# Altium schematic sheet main_scheme.SchDoc
size A1; DocumentNumber: 1; SheetNumber: 1; SheetTotal: 8
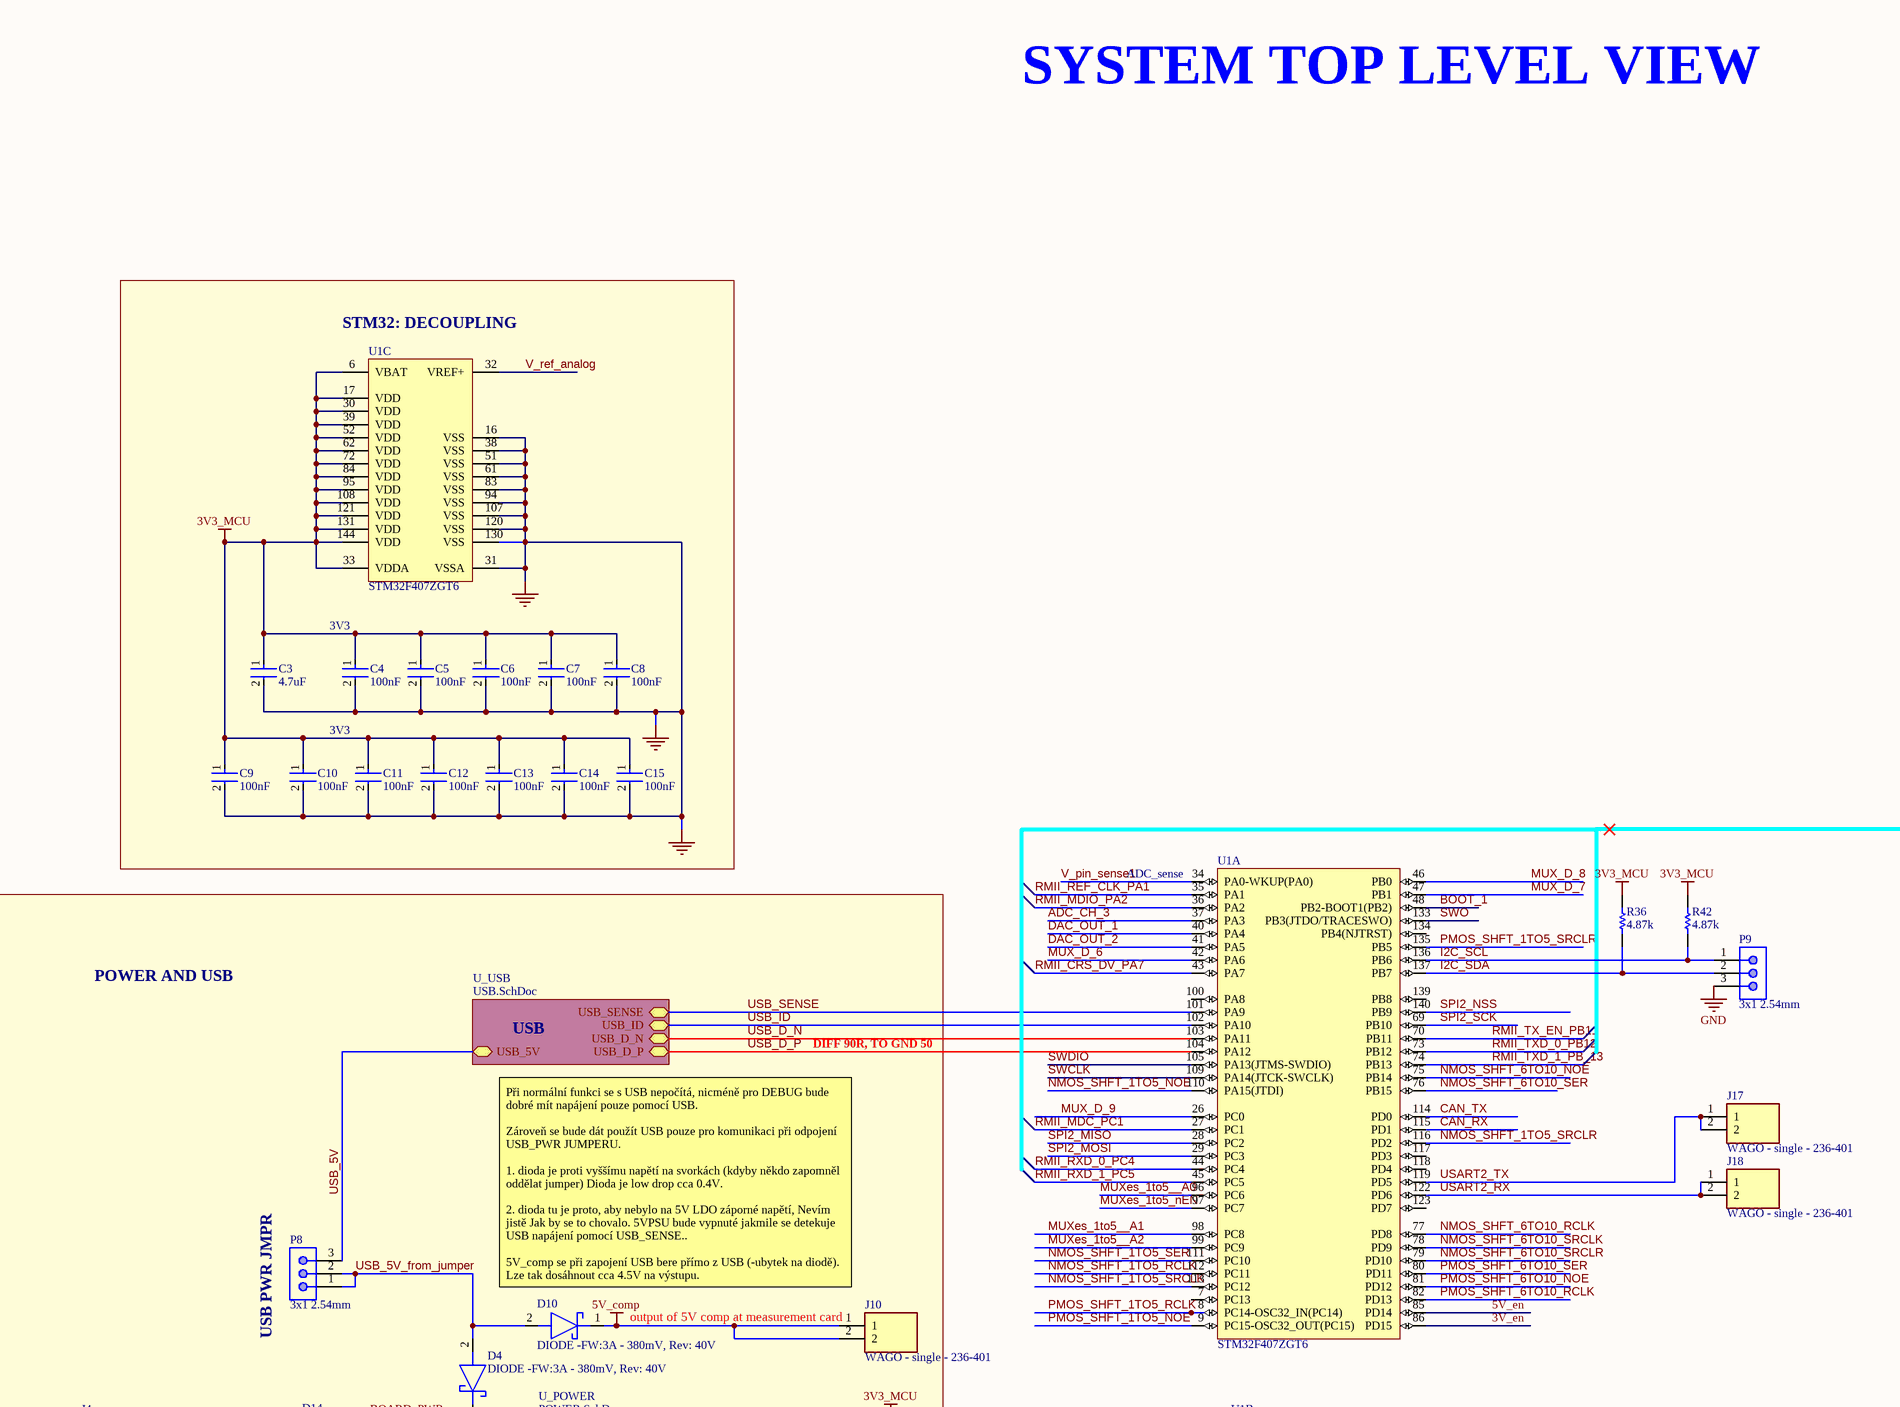
[diagram p0: main_scheme.SchDoc, top left]
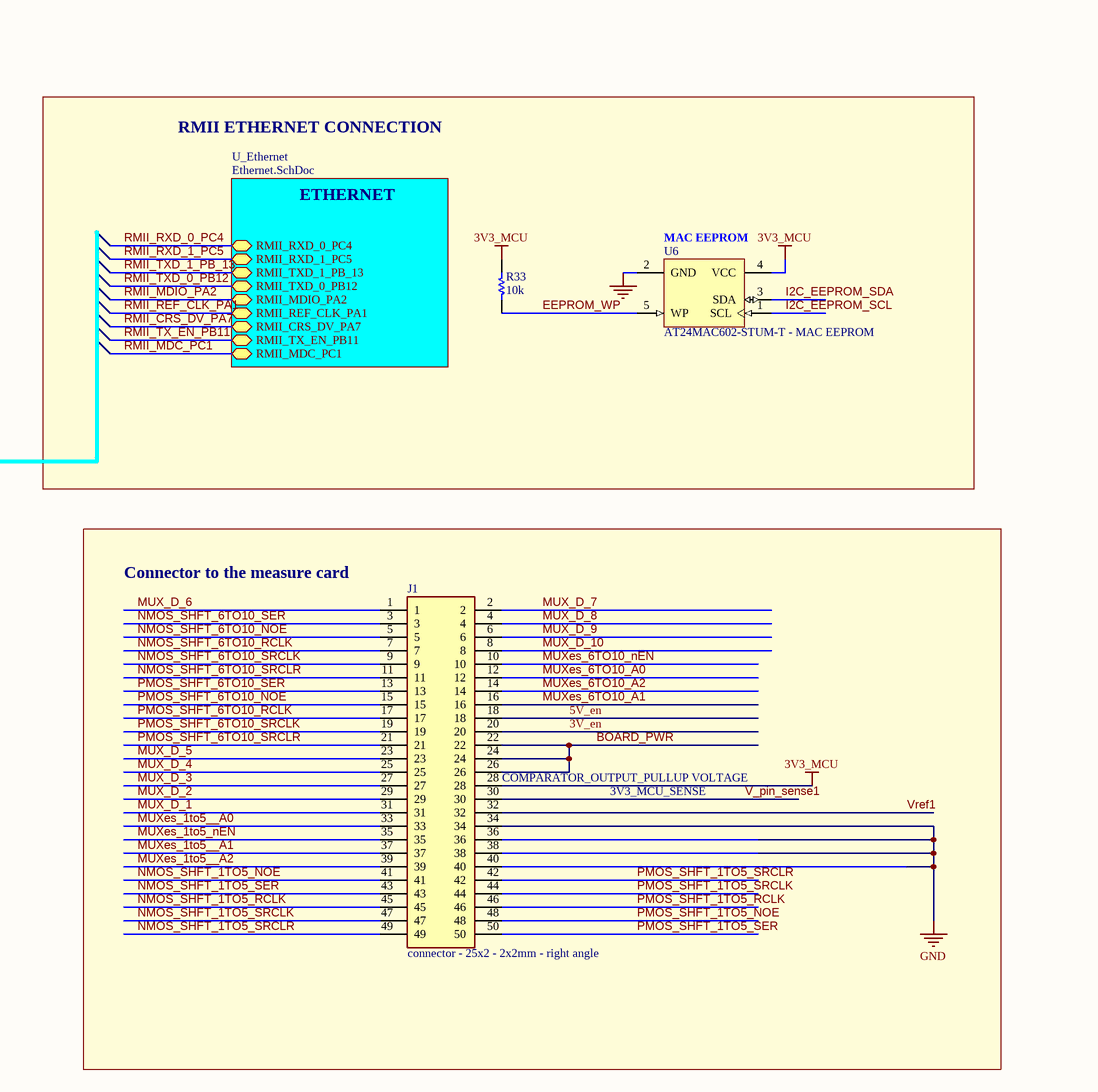
[diagram p1: main_scheme.SchDoc, top right]
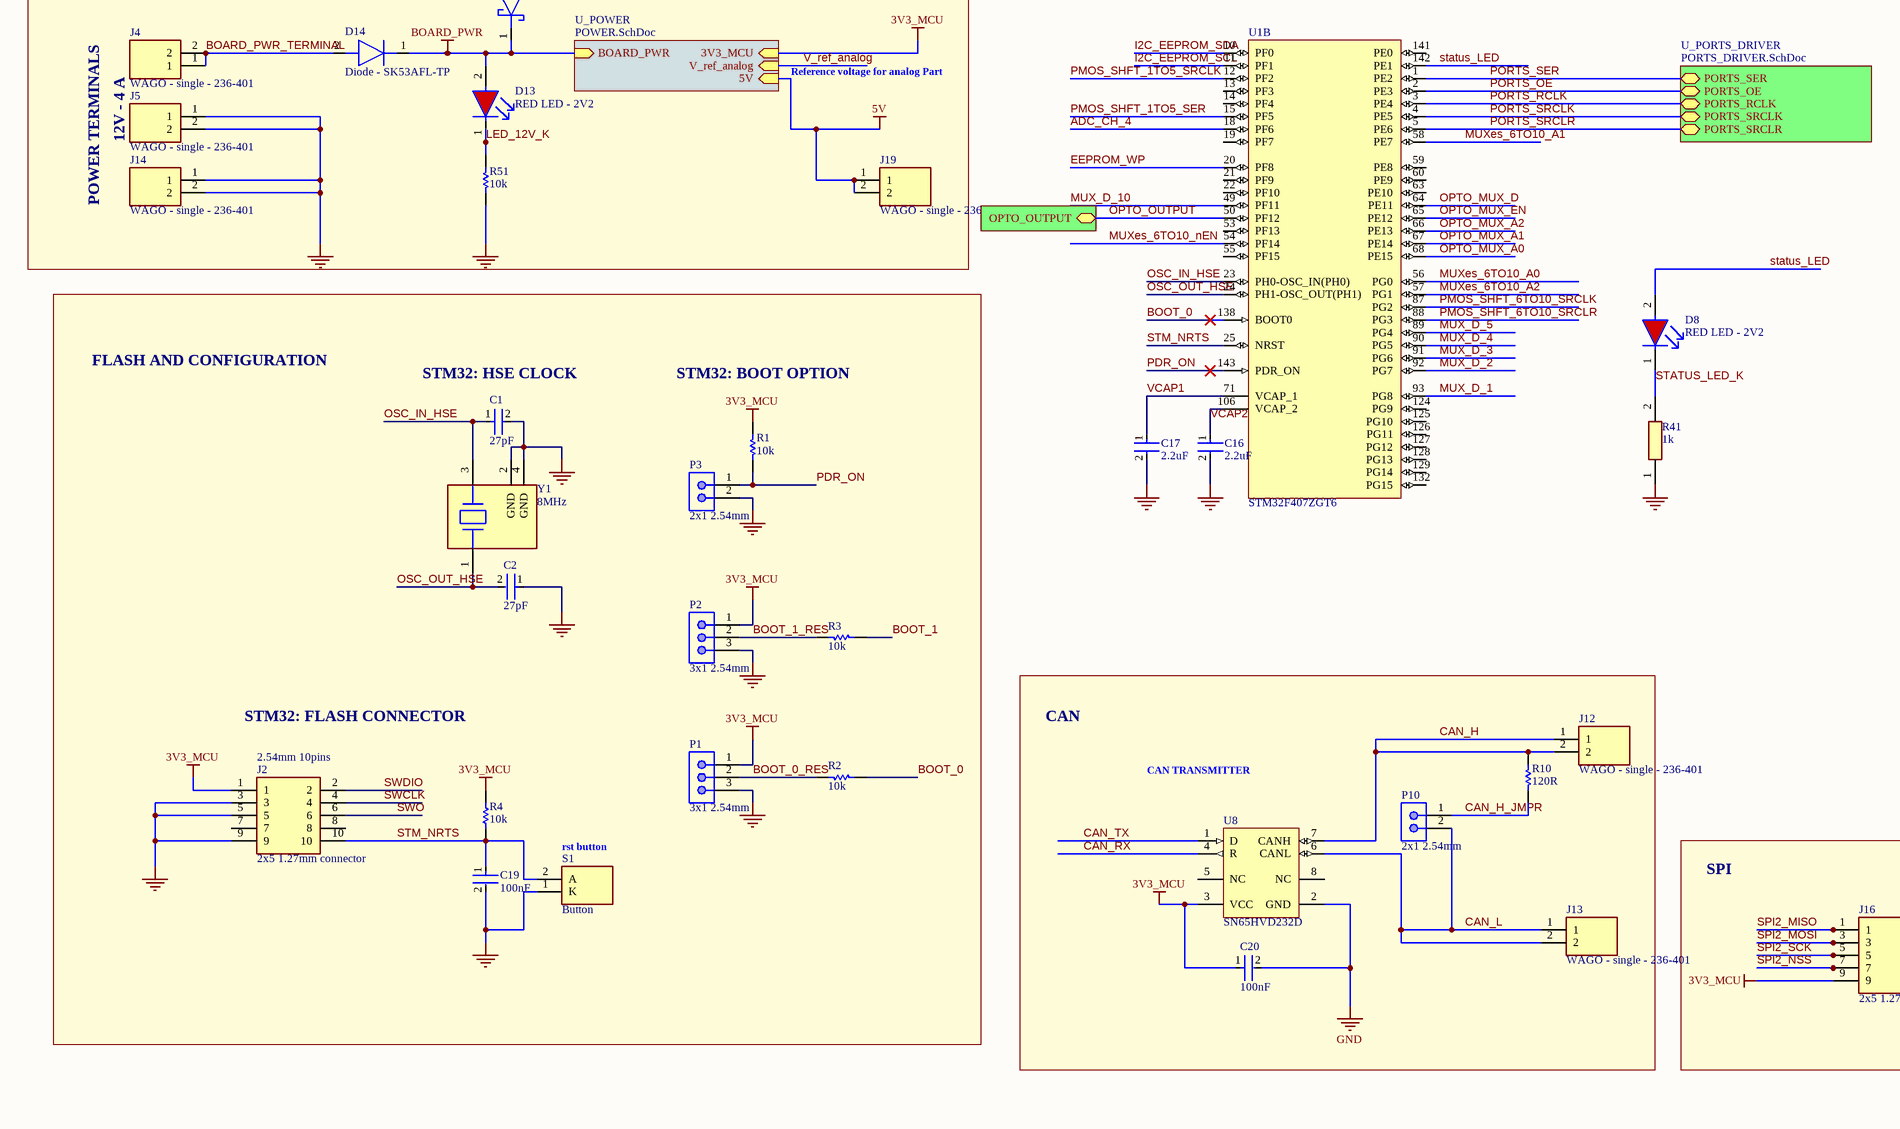
[diagram p2: main_scheme.SchDoc, bottom left]
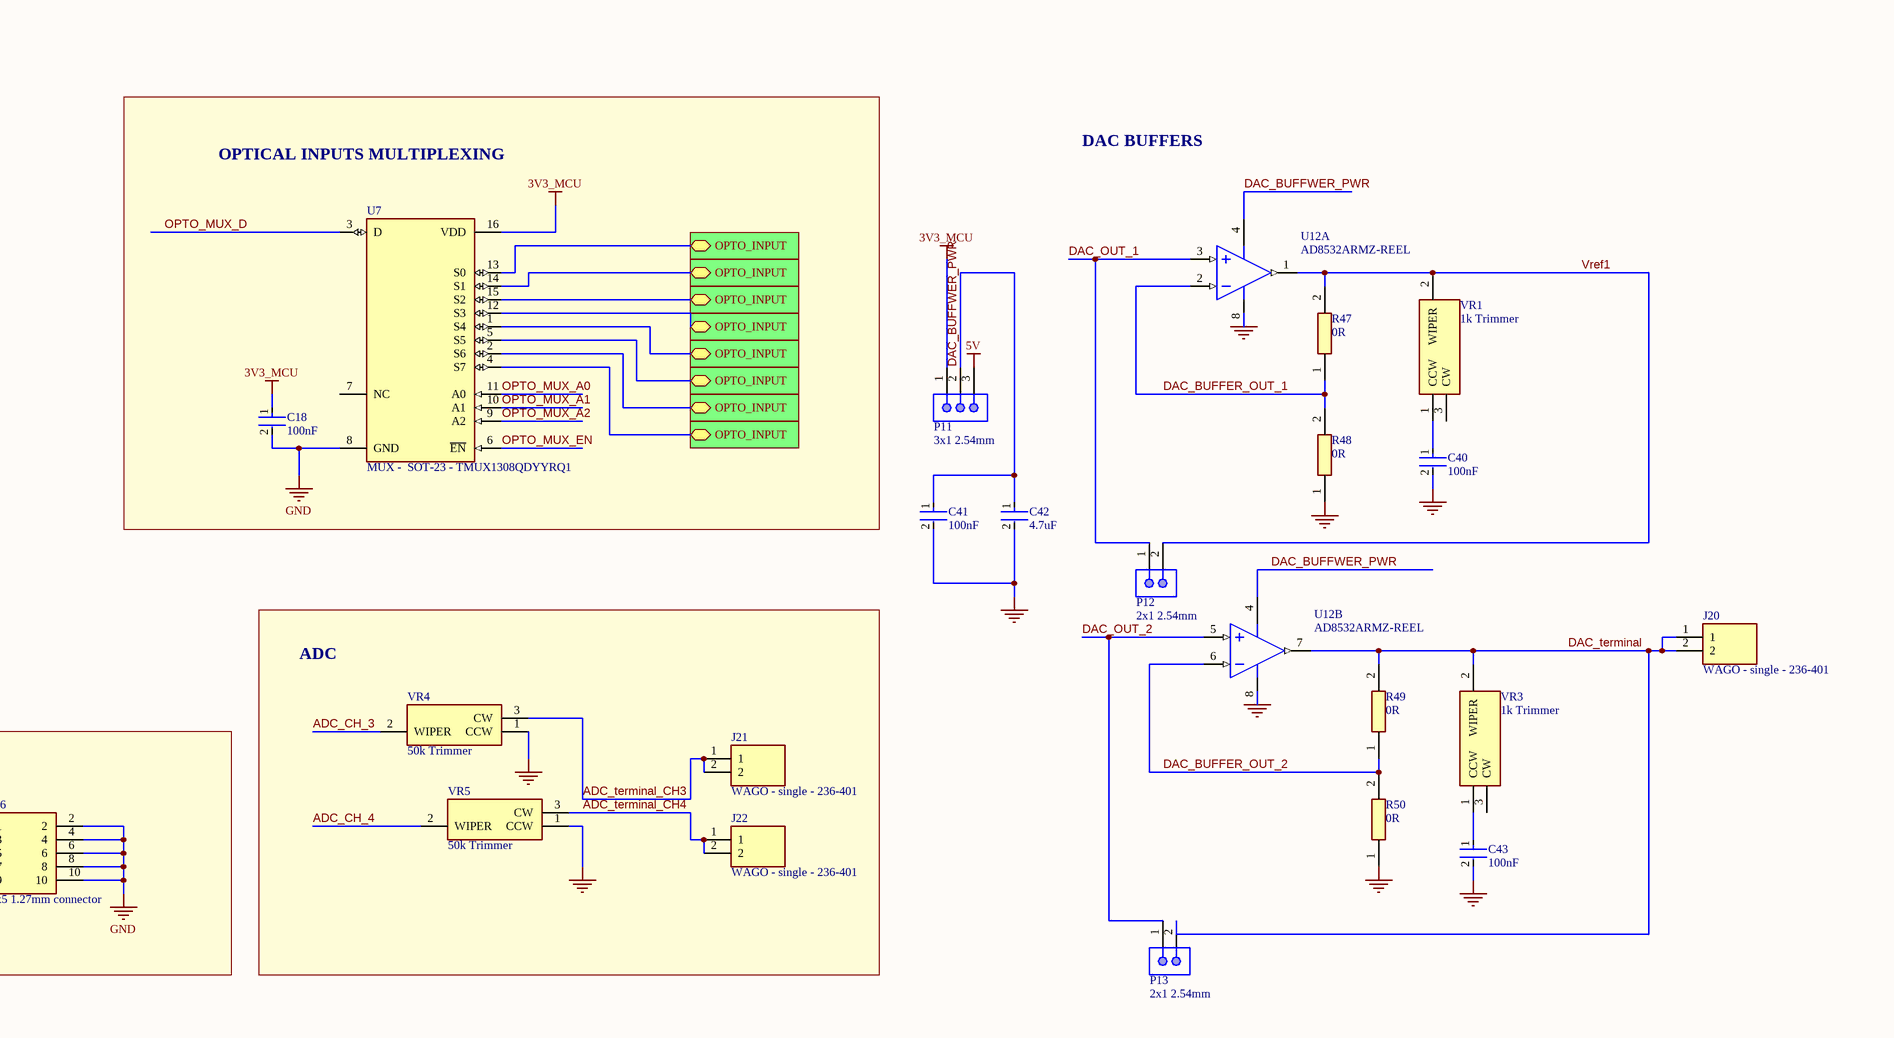
[diagram p3: main_scheme.SchDoc, bottom right]

## Parts
C1  27pF  [0402 CAP]
C2  27pF  [0402 CAP]
C3  4.7uF  [0603-CAP]
C4  100nF  [0402 CAP]
C5  100nF  [0402 CAP]
C6  100nF  [0402 CAP]
C7  100nF  [0402 CAP]
C8  100nF  [0402 CAP]
C9  100nF  [0402 CAP]
C10  100nF  [0402 CAP]
C11  100nF  [0402 CAP]
C12  100nF  [0402 CAP]
C13  100nF  [0402 CAP]
C14  100nF  [0402 CAP]
C15  100nF  [0402 CAP]
C16  2.2uF  [0603-CAP]
C17  2.2uF  [0603-CAP]
C18  100nF  [0402 CAP]
C19  100nF  [0402 CAP]
C20  100nF  [0402 CAP]
C40  100nF  [0402 CAP]
C41  100nF  [0402 CAP]
C42  4.7uF  [0603-CAP]
C43  100nF  [0402 CAP]
D4  DIODE -FW:3A - 380mV, Rev: 40V  [DIONM5127X229N]
D8  RED LED - 2V2  [0603_RED_LED]
D10  DIODE -FW:3A - 380mV, Rev: 40V  [DIONM5127X229N]
D13  RED LED - 2V2  [0603_RED_LED]
D14  Diode - SK53AFL-TP  [SODFL5026X120N]
J1  connector - 25x2 - 2x2mm - right angle  [SHDRRA50W55P200_2X25_5265X640X630P_RIGHT]
J2  2x5 1.27mm connector  [FTSH-105-XX-YYY-D]
J4  WAGO - single - 236-401  [WAGO-236-601]
J5  WAGO - single - 236-401  [WAGO-236-601]
J10  WAGO - single - 236-401  [WAGO-236-601]
J12  WAGO - single - 236-401  [WAGO-236-601]
J13  WAGO - single - 236-401  [WAGO-236-601]
J14  WAGO - single - 236-401  [WAGO-236-601]
J16  2x5 1.27mm connector  [FTSH-105-XX-YYY-D]
J17  WAGO - single - 236-401  [WAGO-236-601]
J18  WAGO - single - 236-401  [WAGO-236-601]
J19  WAGO - single - 236-401  [WAGO-236-601]
J20  WAGO - single - 236-401  [WAGO-236-601]
J21  WAGO - single - 236-401  [WAGO-236-601]
J22  WAGO - single - 236-401  [WAGO-236-601]
P1  3x1 2.54mm  [3x1 2.54mm header]
P2  3x1 2.54mm  [3x1 2.54mm header]
P3  2x1 2.54mm  [2.54mm header 2x1]
P8  3x1 2.54mm  [3x1 2.54mm header]
P9  3x1 2.54mm  [3x1 2.54mm header]
P10  2x1 2.54mm  [2.54mm header 2x1]
P11  3x1 2.54mm  [3x1 2.54mm header]
P12  2x1 2.54mm  [2.54mm header 2x1]
P13  2x1 2.54mm  [2.54mm header 2x1]
R1  10k  [RESC1005X40X25NL05T05]
R2  10k  [RESC1005X40X25NL05T05]
R3  10k  [RESC1005X40X25NL05T05]
R4  10k  [RESC1005X40X25NL05T05]
R10  120R  [RESC1005X40X25NL05T05]
R33  10k  [RESC1005X40X25NL05T05]
R36  4.87k  [RESC1005X40X25NL05T05]
R41  1k  [0603- SMD resistor]
R42  4.87k  [RESC1005X40X25NL05T05]
R47  0R  [0603- SMD resistor]
R48  0R  [0603- SMD resistor]
R49  0R  [0603- SMD resistor]
R50  0R  [0603- SMD resistor]
R51  10k  [RESC1005X40X25NL05T05]
S1  Button  [B3U-1000P]
U1  STM32F407ZGT6  [STM-LQFP144_L]  (parts A,B,C of 3)
U6  AT24MAC602-STUM-T - MAC EEPROM  [ATML-5TS1_L]
U7  MUX -  SOT-23 - TMUX1308QDYYRQ1  [FP-DYY0016A-MFG]
U8  SN65HVD232D  [D0008A_L]
U12  AD8532ARMZ-REEL  [ADI-RM-8_L]  (parts A,B of 2)
VR1  1k Trimmer  [TC33X2503E]
VR3  1k Trimmer  [TC33X2503E]
VR4  50k Trimmer  [TC33X2503E]
VR5  50k Trimmer  [TC33X2503E]
Y1  8MHz  [4_pin_OSCILATOR]

## Blocks framed on the sheet
STM32: DECOUPLING: C3-C15 U1
Connector to the measure card: J1
OPTICAL INPUTS MULTIPLEXING: C18 U7
CAN: C20 J12 J13 P10 R10 U8
ADC: J21 J22 VR4 VR5
SPI: J16

## Sub-sheets
U_Ethernet = Ethernet.SchDoc: RMII_RXD_0_PC4 (bidir), RMII_RXD_1_PC5 (bidir), RMII_TXD_1_PB_13 (bidir), RMII_TXD_0_PB12 (bidir), RMII_MDIO_PA2 (bidir), RMII_REF_CLK_PA1 (bidir), RMII_CRS_DV_PA7 (bidir), RMII_TX_EN_PB11 (bidir), RMII_MDC_PC1 (bidir)
U_Opto_inputs = Opto_inputs.SchDoc: OPTO_INPUT (bidir)
U_Opto_inputs = Opto_inputs.SchDoc: OPTO_INPUT (bidir)
U_Opto_inputs = Opto_inputs.SchDoc: OPTO_INPUT (bidir)
U_Opto_inputs = Opto_inputs.SchDoc: OPTO_INPUT (bidir)
U_Opto_inputs = Opto_inputs.SchDoc: OPTO_INPUT (bidir)
U_Opto_inputs = Opto_inputs.SchDoc: OPTO_INPUT (bidir)
U_Opto_inputs = Opto_inputs.SchDoc: OPTO_INPUT (bidir)
U_Opto_inputs = Opto_inputs.SchDoc: OPTO_INPUT (bidir)
U_Opto_outputs = Opto_outputs.SchDoc: OPTO_OUTPUT (bidir)
U_PORTS_DRIVER = PORTS_DRIVER.SchDoc: PORTS_SER (bidir), PORTS_SRCLR (bidir), PORTS_RCLK (bidir), PORTS_SRCLK (bidir), PORTS_OE (bidir)
U_POWER = POWER.SchDoc: 3V3_MCU (in), BOARD_PWR (in), V_ref_analog (in), 5V (in)
U_USB = USB.SchDoc: USB_5V (bidir), USB_D_P (bidir), USB_D_N (bidir), USB_ID (bidir), USB_SENSE (bidir)

## Nets
3V3_MCU: C3.1 C4.1 C5.1 C6.1 C7.1 C8.1 C9.1 C10.1 C11.1 C12.1 C13.1 C14.1 C15.1 C18.1 C20.1 J1.28 J2.1 J16.9 P1.1 P2.1 P11.1 R1.1 R4.1 R33.1 R36.1 R42.1 U1.6(VBAT) U1.17(VDD) U1.30(VDD) U1.33(VDDA) U1.39(VDD) U1.52(VDD) U1.62(VDD) U1.72(VDD) U1.84(VDD) U1.95(VDD) U1.108(VDD) U1.121(VDD) U1.131(VDD) U1.144(VDD) U6.4(VCC) U7.16(VDD) U8.3(VCC) ; sheet U_POWER/3V3_MCU
5V: J19.1 J19.2 P11.3 ; sheet U_POWER/5V
5V_comp: D10.1(K) J10.1 J10.2
BOARD_PWR: D4.1(K) D13.2(A) D14.1(K) J1.22 J1.24 J1.26 ; sheet U_POWER/BOARD_PWR
GND: C1.2 C2.1 C3.2 C4.2 C5.2 C6.2 C7.2 C8.2 C9.2 C10.2 C11.2 C12.2 C13.2 C14.2 C15.2 C16.2 C17.2 C18.2 C19.2 C20.2 C40.2 C41.2 C42.2 C43.2 J1.34 J1.36 J1.38 J1.40 J2.3 J2.5 J2.9 J5.1 J5.2 J14.1 J14.2 J16.2 J16.4 J16.6 J16.8 J16.10 P1.3 P2.3 P3.2 P9.3 R41.1 R48.1 R50.1 R51.1 S1.1(K) U1.16(VSS) U1.31(VSSA) U1.38(VSS) U1.51(VSS) U1.61(VSS) U1.83(VSS) U1.94(VSS) U1.107(VSS) U1.120(VSS) U1.130(VSS) U6.2(GND) U7.8(GND) U8.2(GND) U12.8(+V) VR4.1(CCW) VR5.1(CCW) Y1.2(GND) Y1.4(GND)
3V_en: J1.20 U1.86(PD15)
5V_en: J1.18 U1.85(PD14)
ADC_CH_3: U1.37(PA3) VR4.2(WIPER)
ADC_CH_4: U1.18(PF6) VR5.2(WIPER)
ADC_terminal_CH3: J21.1 J21.2 VR4.3(CW)
ADC_terminal_CH4: J22.1 J22.2 VR5.3(CW)
BOARD_PWR_TERMINAL: D14.2(A) J4.1 J4.2
BOOT_0: R2.2 U1.138(BOOT0)
BOOT_0_RES: P1.2 R2.1
BOOT_1: R3.2 U1.48(PB2-BOOT1(PB2))
BOOT_1_RES: P2.2 R3.1
CAN_H: J12.1 J12.2 R10.2 U8.7(CANH)
CAN_H_JMPR: P10.1 R10.1
CAN_L: J13.1 J13.2 P10.2 U8.6(CANL)
CAN_RX: U1.115(PD1) U8.4(R)
CAN_TX: U1.114(PD0) U8.1(D)
DAC_BUFFER_OUT_1: R47.1 R48.2 U12.2(-IN_A)
DAC_BUFFER_OUT_2: R49.1 R50.2 U12.6(-IN_B)
DAC_BUFFWER_PWR: C41.1 C42.1 P11.2 U12.4(-V)
DAC_OUT_1: P12.1 U1.40(PA4) U12.3(+IN_A)
DAC_OUT_2: P13.1 U1.41(PA5) U12.5(+IN_B)
DAC_terminal: J20.1 J20.2 P13.2 R49.2 U12.7(OUT_B) VR3.2(WIPER)
EEPROM_WP: R33.2 U1.20(PF8) U6.5(WP)
I2C_EEPROM_SCL: U1.11(PF1) U6.1(SCL)
I2C_EEPROM_SDA: U1.10(PF0) U6.3(SDA)
I2C_SCL: P9.1 R42.2 U1.136(PB6)
I2C_SDA: P9.2 R36.2 U1.137(PB7)
LED_12V_K: D13.1(C) R51.2
MUX_D_1: J1.31 U1.93(PG8)
MUX_D_2: J1.29 U1.92(PG7)
MUX_D_3: J1.27 U1.91(PG6)
MUX_D_4: J1.25 U1.90(PG5)
MUX_D_5: J1.23 U1.89(PG4)
MUX_D_6: J1.1 U1.42(PA6)
MUX_D_7: J1.2 U1.47(PB1)
MUX_D_8: J1.4 U1.46(PB0)
MUX_D_9: J1.6 U1.26(PC0)
MUX_D_10: J1.8 U1.49(PF11)
MUXes_1to5__A0: J1.33 U1.96(PC6)
MUXes_1to5__A1: J1.37 U1.98(PC8)
MUXes_1to5__A2: J1.39 U1.99(PC9)
MUXes_1to5_nEN: J1.35 U1.97(PC7)
MUXes_6TO10_A0: J1.12 U1.56(PG0)
MUXes_6TO10_A1: J1.16 U1.58(PE7)
MUXes_6TO10_A2: J1.14 U1.57(PG1)
MUXes_6TO10_nEN: J1.10 U1.54(PF14)
NMOS_SHFT_1TO5_NOE: J1.41 U1.110(PA15(JTDI))
NMOS_SHFT_1TO5_RCLK: J1.45 U1.112(PC11)
NMOS_SHFT_1TO5_SER: J1.43 U1.111(PC10)
NMOS_SHFT_1TO5_SRCLK: J1.47 U1.113(PC12)
NMOS_SHFT_1TO5_SRCLR: J1.49 U1.116(PD2)
NMOS_SHFT_6TO10_NOE: J1.5 U1.75(PB14)
NMOS_SHFT_6TO10_RCLK: J1.7 U1.77(PD8)
NMOS_SHFT_6TO10_SER: J1.3 U1.76(PB15)
NMOS_SHFT_6TO10_SRCLK: J1.9 U1.78(PD9)
NMOS_SHFT_6TO10_SRCLR: J1.11 U1.79(PD10)
OPTO_MUX_A0: U1.68(PE15) U7.11(A0)
OPTO_MUX_A1: U1.67(PE14) U7.10(A1)
OPTO_MUX_A2: U1.66(PE13) U7.9(A2)
OPTO_MUX_D: U1.64(PE11) U7.3(D)
OPTO_MUX_EN: U1.65(PE12) U7.6(~{EN})
OPTO_OUTPUT: U1.50(PF12) ; sheet U_Opto_outputs/OPTO_OUTPUT
OSC_IN_HSE: C1.1 U1.23(PH0-OSC_IN(PH0)) Y1.3
OSC_OUT_HSE: C2.2 U1.24(PH1-OSC_OUT(PH1)) Y1.1
PDR_ON: P3.1 R1.2 U1.143(PDR_ON)
PMOS_SHFT_1TO5_NOE: J1.48 U1.9(PC15-OSC32_OUT(PC15))
PMOS_SHFT_1TO5_RCLK: J1.46 U1.8(PC14-OSC32_IN(PC14))
PMOS_SHFT_1TO5_SER: J1.50 U1.15(PF5)
PMOS_SHFT_1TO5_SRCLK: J1.44 U1.12(PF2)
PMOS_SHFT_1TO5_SRCLR: J1.42 U1.135(PB5)
PMOS_SHFT_6TO10_NOE: J1.15 U1.81(PD12)
PMOS_SHFT_6TO10_RCLK: J1.17 U1.82(PD13)
PMOS_SHFT_6TO10_SER: J1.13 U1.80(PD11)
PMOS_SHFT_6TO10_SRCLK: J1.19 U1.87(PG2)
PMOS_SHFT_6TO10_SRCLR: J1.21 U1.88(PG3)
PORTS_OE: U1.2(PE3) ; sheet U_PORTS_DRIVER/PORTS_OE
PORTS_RCLK: U1.3(PE4) ; sheet U_PORTS_DRIVER/PORTS_RCLK
PORTS_SER: U1.1(PE2) ; sheet U_PORTS_DRIVER/PORTS_SER
PORTS_SRCLK: U1.4(PE5) ; sheet U_PORTS_DRIVER/PORTS_SRCLK
PORTS_SRCLR: U1.5(PE6) ; sheet U_PORTS_DRIVER/PORTS_SRCLR
RMII_CRS_DV_PA7: U1.43(PA7) ; sheet U_Ethernet/RMII_CRS_DV_PA7
RMII_MDC_PC1: U1.27(PC1) ; sheet U_Ethernet/RMII_MDC_PC1
RMII_MDIO_PA2: U1.36(PA2) ; sheet U_Ethernet/RMII_MDIO_PA2
RMII_REF_CLK_PA1: U1.35(PA1) ; sheet U_Ethernet/RMII_REF_CLK_PA1
RMII_RXD_0_PC4: U1.44(PC4) ; sheet U_Ethernet/RMII_RXD_0_PC4
RMII_RXD_1_PC5: U1.45(PC5) ; sheet U_Ethernet/RMII_RXD_1_PC5
RMII_TX_EN_PB11: U1.70(PB11) ; sheet U_Ethernet/RMII_TX_EN_PB11
RMII_TXD_0_PB12: U1.73(PB12) ; sheet U_Ethernet/RMII_TXD_0_PB12
RMII_TXD_1_PB_13: U1.74(PB13) ; sheet U_Ethernet/RMII_TXD_1_PB_13
SPI2_MISO: J16.1 U1.28(PC2)
SPI2_MOSI: J16.3 U1.29(PC3)
SPI2_NSS: J16.7 U1.140(PB9)
SPI2_SCK: J16.5 U1.69(PB10)
status_LED: D8.2(A) U1.142(PE1)
STATUS_LED_K: D8.1(C) R41.2
STM_NRTS: C19.1 J2.10 R4.2 S1.2(A) U1.25(NRST)
SWCLK: J2.4 U1.109(PA14(JTCK-SWCLK))
SWDIO: J2.2 U1.105(PA13(JTMS-SWDIO))
SWO: J2.6 U1.133(PB3(JTDO/TRACESWO))
USART2_RX: J18.1 J18.2 U1.122(PD6)
USART2_TX: J17.1 J17.2 U1.119(PD5)
USB_5V: P8.3 ; sheet U_USB/USB_5V
USB_5V_from_jumper: D4.2(A) D10.2(A) P8.1 P8.2
USB_D_N: U1.103(PA11) ; sheet U_USB/USB_D_N
USB_D_P: U1.104(PA12) ; sheet U_USB/USB_D_P
USB_ID: U1.102(PA10) ; sheet U_USB/USB_ID
USB_SENSE: U1.101(PA9) ; sheet U_USB/USB_SENSE
V_pin_sense1: J1.30 U1.34(PA0-WKUP(PA0))
V_ref_analog: U1.32(VREF+) ; sheet U_POWER/V_ref_analog
VCAP1: C17.1 U1.71(VCAP_1)
VCAP2: C16.1 U1.106(VCAP_2)
Vref1: J1.32 P12.2 R47.2 U12.1(OUT_A) VR1.2(WIPER)
NetC40_1: C40.1 VR1.1(CCW)
NetC43_1: C43.1 VR3.1(CCW)
NetU7_1: U7.1(S4) ; sheet U_Opto_inputs/OPTO_INPUT
NetU7_2: U7.2(S6) ; sheet U_Opto_inputs/OPTO_INPUT
NetU7_4: U7.4(S7) ; sheet U_Opto_inputs/OPTO_INPUT
NetU7_5: U7.5(S5) ; sheet U_Opto_inputs/OPTO_INPUT
NetU7_12: U7.12(S3) ; sheet U_Opto_inputs/OPTO_INPUT
NetU7_13: U7.13(S0) ; sheet U_Opto_inputs/OPTO_INPUT
NetU7_14: U7.14(S1) ; sheet U_Opto_inputs/OPTO_INPUT
NetU7_15: U7.15(S2) ; sheet U_Opto_inputs/OPTO_INPUT

Not connected (* = marked no-connect by the designer): J2 7 8; U1 7(PC13) 13(PF3) 14(PF4) 19(PF7) 21(PF9) 22(PF10) 53(PF13) 55(PF15) 59(PE8) 60(PE9) 63(PE10) 100(PA8) 117(PD3) 118(PD4) 123(PD7) 124(PG9) 125(PG10) 126(PG11) 127(PG12) 128(PG13) 129(PG14) 132(PG15) 134(PB4(NJTRST)) 139(PB8) 141(PE0); U7 7(NC); U8 5(NC) 8(NC); VR1 3(CW); VR3 3(CW)

## Notes on the sheet
- SYSTEM TOP LEVEL VIEW
- RMII ETHERNET CONNECTION
- ETHERNET
- 3V3
- (near U6) MAC EEPROM
- (near U1) ADC_sense
- POWER AND USB
- USB
- DIFF 90R, TO GND 50
- (near J1) COMPARATOR_OUTPUT_PULLUP VOLTAGE
- 3V3_MCU_SENSE
- Při normální funkci se s USB nepočítá, nicméně pro DEBUG bude dobré mít napájení pouze pomocí USB.
  Zároveň se bude dát použít USB pouze pro komunikaci při odpojení
  USB_PWR JUMPERU.
  1. dioda je proti vyššímu napětí na svorkách (kdyby někdo zapomněl oddělat jumper) Dioda je low drop cca 0.4V.
  2. dioda tu je proto, aby nebylo na 5V LDO záporné napětí, Nevím jistě Jak by se to chovalo. 5VPSU bude vypnuté jakmile se detekuje USB napájení pomocí USB_SENSE..
  5V_comp se při zapojení USB bere přímo z USB (-ubytek na diodě). Lze tak dosáhnout cca 4.5V na výstupu.
  4.4 by snad mělo stačit, aby LDO udrželo alespoň 3V3 na výstupu při 1A
- (near P8) USB PWR JMPR
- (near J10) output of 5V comp at measurement card
- Reference voltage for analog Part
- 12V - 4 A
- POWER TERMINALS
- DAC BUFFERS
- FLASH AND CONFIGURATION
- (near C1) STM32: HSE CLOCK
- STM32: BOOT OPTION
- STM32: FLASH CONNECTOR
- (near J2) 2.54mm 10pins
- CAN TRANSMITTER
- (near S1) rst button

## Library data of the parts
C1 C2 = CAP 0402 - 27pF: Cap Ceramic 0402, 27pF, 25V,10%; PartNumber: C0402C270K3GACTU; Value: 27pF; Package: 0402; Supplier 1: Mouser; Supplier Part Number 1: 80-C0402C270K3G; ComponentLink1Description: myLinks; ComponentLink1URL: https://eu.mouser.com/ProductDetail/KEMET/C0402C270K3GACTU?qs=v7s4VpRpa0t5WS52qYyghQ%3D%3D
C3 C42 = CAP-0603-4.7uF: General Purpose Ceramic Capacitor, 0603,4.7uF,35V,10%; PartNumber: C1608X5R1V475K080AC; ComponentLink1Description: myLinks; ComponentLink1URL: https://cz.mouser.com/ProductDetail/TDK/C1608X5R1V475K080AC?qs=dfay7wIA1uF9DVjUL4K4oA%3D%3D; Package: 0603; Value: 4.7uF; Supplier 1: Mouser; Supplier Part Number 1: 810-C1608X5R1V475K
C4-C15 C18-C20 C40 C41 C43 = CAP 0402 - 100nF: Cap Ceramic 0402,0.1uF, 25V,10%; PartNumber: C0402C104K3RACTU; Value: 100nF; Package: 0402; Supplier 1: Mouser; Supplier Part Number 1: 80-C0402C104K3R; ComponentLink1Description: myLinks; ComponentLink1URL: https://eu.mouser.com/ProductDetail/KEMET/C0402C104K3RACTU?qs=YCcZ0GhAU2q7BaxZ%2FluQHA%3D%3D
C16 C17 = CAP-0603-2.2uF: General Purpose Ceramic Capacitor, 0603,2.2uF,35V,10%; PartNumber: C1608JB1V225K080AC; ComponentLink1Description: myLinks; ComponentLink1URL: https://cz.mouser.com/ProductDetail/TDK/C1608JB1V225K080AC?qs=xLDY6iXSiQbY%2FrhN9AA4AA%3D%3D; Package: 0603; Value: 2.2uF; Supplier 1: Mouser; Supplier Part Number 1: 810-C1608JB1V225K08C
D4 D10 = DIODE -FW:3A - 380mV, Rev: 40V: Schottky DIODE -  DO-214AC-2 -FW:3A - 380mV, Rev: 40V; PartNumber: SSA34HE3_A/I; ComponentLink1Description: New link; ComponentLink1URL: https://cz.mouser.com/ProductDetail/Vishay-General-Semiconductor/SSA34HE3_A-I?qs=asPD7ZL2j3VimMFbwwU%2FoA%3D%3D; Value: FW:3A - 380mV, Rev: 40V; Package: DO-214AC-2; Supplier 1: Mouser; Supplier Part Number 1: 78-SSA34HE3_A/I
D8 D13 = LED - 0603 - RED - 2V2: LED RED DIFFUSED 0603 SMD; PartNumber: SML-D12U1WT86; Value: RED LED - 2.2V; Package: 0602; ComponentLink1Description: myLinks; ComponentLink1URL: https://cz.mouser.com/ProductDetail/ROHM-Semiconductor/SML-D12U1WT86?qs=M3jcYzEJUdEySuGkbjHEtQ%3D%3D; Supplier 1: Mouser; Supplier Part Number 1: 755-SML-D12U1WT86
D14 = Diode - SK53AFL-TP: Diode - 5A shottky Rectifier, Fw: 5A, 0.7V Revers: 30V, DO-221AC-2; Value: Fw: 5A, 0.7V Revers: 30V; Package: DO-221AC-2; PartNumber: SK53AFL-TP; ComponentLink1Description: myLinks; ComponentLink1URL: https://cz.mouser.com/ProductDetail/Micro-Commercial-Components-MCC/SK53AFL-TP?qs=sGAEpiMZZMtbRapU8LlZD%252B6h%2FWulpAkrF6E5wLTt2R0xTCwpYWNMog%3D%3D; Supplier 1: Mouser; Supplier Part Number 1: 833-SK53AFL-TP
J1 = connector - 25x2 - 2x2mm - right angle: Connector - connector - 25x2 - 2x2mm, SAMTEC - right angle; PartNumber: STMM-125-02-S-D-RA; ComponentLink1Description: myLinks; ComponentLink1URL: https://cz.mouser.com/ProductDetail/Samtec/STMM-125-02-S-D-RA?qs=rU5fayqh%252BE3bRISkmlmqKg%3D%3D; Value: 25x2 - 2x2mm -right angle; Package: 25x2 - 2x2mm -right angle; Supplier 1: Mouser; Supplier Part Number 1: 200-STMM12502SDRA
J2 J16 = Connector - 2x5 -1.27 x 1.27mm: Connector - 2x5positions -  1.27mm x1.27mm; PartNumber: FTSH-105-04-F-D; Value: 2x5 1.27mm x 1.27mm; Package: 2x5positions -  1.27mm x1.27mm; ComponentLink1Description: myLinks; ComponentLink1URL: https://cz.mouser.com/ProductDetail/Samtec/FTSH-105-04-F-D?qs=0lQeLiL1qyZx0H067ICkhw%3D%3D; Supplier 1: Mouser; Supplier Part Number 1: 200-FTSH10504FDV
J4 J5 J10 J12-J14 J17-J22 = WAGO - single - 236-401: Wago connector - PCB to wire - single - 24A 320V; ComponentLink1Description: myLinks; ComponentLink1URL: https://cz.farnell.com/wago/236-401/terminal-block-wire-to-brd-1pos/dp/1891620?gclid=CjwKCAiAu5agBhBzEiwAdiR5tFj9uwuLgrlShO914YuSUEtsU0o4Hiox7ZjRnpSnFBbtyRYLbKYJWxoC0xgQAvD_BwE&mckv=sEoohdYPd_dc|pcrid|263733373421|kword|+wago%20+236-401|match|b|plid||slid||product||pgrid|56870816529|ptaid|kwd-298399736559|&CMP=KNC-GCZ-GEN-SKU-MDC; Value: 24A 320V; Package: 236-401; PartNumber: 236-401; Supplier 1: Farnell; Supplier Part Number 1: 1891620
P1 P2 P8 P9 P11 = Header - 3x1 2.54mm: Headers & Wire Housings 3P HEADER GOLD 15u single row; PartNumber: 5-146280-3; Value: 3x1 2.54mm; Package: 3x1 2.54mm; ComponentLink1Description: myLinks; ComponentLink1URL: https://cz.mouser.com/ProductDetail/TE-Connectivity/5-146280-3?qs=bwpFY26eRVf7xnwkMZzVxA%3D%3D; Supplier 1: Mouser; Supplier Part Number 1: 571-5-146280-3
P3 P10 P12 P13 = Header - 2x1 2.54mm: Male Header, Pitch 2.54 mm, 1 x 2 Position, Height 8.21 mm, Tail Length 3.05 mm, -65 to 105 degC, RoHS, Bulk; PartNumber: 5-146280-2; ComponentLink1Description: myLinks; ComponentLink1URL: https://cz.mouser.com/ProductDetail/TE-Connectivity/5-146280-2?qs=bwpFY26eRVcxHP%252BQexhLNQ%3D%3D; Value: 2x1 2.54mm; Package: 2x1 2.54mm; Supplier 1: Mouser; Supplier Part Number 1: 571-5-146280-2
R1-R4 R33 R51 = Resistor - 0402 -10k: Resistor - 0402 -  10k - 5% - 125mW; PartNumber: RC0402JR-7W10KL; Value: 10k; Package: 0402; ComponentLink1Description: myLinks; ComponentLink1URL: https://cz.mouser.com/ProductDetail/YAGEO/RC0402JR-7W10KL?qs=tggtontpCXPnY%2FhgQXv%2FLg%3D%3D; Supplier 1: Mouser; Supplier Part Number 1: 603-RC0402JR-7W10KL
R10 = Resistor - 0402 -120R: Resistor - 0402 -  120R - 1% - 100mW; PartNumber: ERJ-S02F1200X; Value: 120R; Package: 0402; ComponentLink1Description: myLinks; ComponentLink1URL: https://cz.mouser.com/ProductDetail/Panasonic/ERJ-S02F1200X?qs=Zyl8A9hlmJqrTWz%252BBOpJnw%3D%3D; Supplier 1: Mouser; Supplier Part Number 1: 667-ERJ-S02F1200X
R36 R42 = Resistor - 0402 - 4.87k: Resistor - 0402 -  4.87k - 1% - 100mW; PartNumber: ERJ-2RKF4871X; Value: 4.87k; Package: 0402; ComponentLink1Description: myLinks; ComponentLink1URL: https://cz.mouser.com/ProductDetail/Panasonic/ERJ-2RKF4871X?qs=YMBIwoNQYdV9ZzOLxQ6NUw%3D%3D; Supplier 1: Mouser; Supplier Part Number 1: 667-ERJ-2RKF4871X
R41 = RESISTOR - 0603 - 1k: Resistor 0603 1KR 100mW 1%; PartNumber: RT0603FRE071KL; ComponentLink1Description: myLinks; ComponentLink1URL: https://cz.mouser.com/ProductDetail/YAGEO/RT0603FRE071KL?qs=8cPjvKtxWv68ZVEzoi6JxQ%3D%3D; Value: 1k; Package: 0603; Supplier 1: Mouser; Supplier Part Number 1: 603-RT0603FRE071KL
R47-R50 = RESISTOR - 0603 - 0R: Resistor 0603 0R; PartNumber: ERJ-3GEY0R00V; ComponentLink1Description: myLinks; ComponentLink1URL: https://cz.mouser.com/ProductDetail/Panasonic/ERJ-3GEY0R00V?qs=66DK8nO8gJALIOqOWgiVwg%3D%3D; Value: 0R; Package: 0603; Supplier 1: Mouser; Supplier Part Number 1: 667-ERJ-3GEY0R00V
S1 = Button - smd -2 poles: Push button - 2poles,  L:2.5mm, W:3mm, H:1.2mm, 12VDC - 50mA; Value: 2 poles button - 12V 50mA; ComponentLink1Description: myLinks; ComponentLink1URL: https://www.mouser.co.uk/ProductDetail/Omron-Electronics/B3U-1000P?qs=AO7BQMcsEu4ip80xyf2FwA%3D%3D; Package: L:2.5mm, W:3mm, H:1.2mm; PartNumber: B3U-1000P; Supplier 1: Mouser; Supplier Part Number 1: 653-B3U-1000P
U1 = STM32F407ZGT6: ARM Cortex-M4 32-bit MCU+FPU, 210 DMIPS, 1024 kB Flash, 192 kB Internal RAM, 114 I/Os, 144-pin LQFP, -40 to 85 degC, Tray; Value: Cortex - M4 uC; PartNumber: STM32F407ZGT6; ComponentLink1URL: https://cz.mouser.com/ProductDetail/STMicroelectronics/STM32F407ZGT6?qs=Z8%252BeY1k3TIKo142SZNWnSQ%3D%3D; ComponentLink1Description: myLinks; Package: LQFP144; Supplier 1: Mouser; Supplier Part Number 1: 511-STM32F407ZGT6
U6 = MAC_EEPROM_I2C: 2-Kbit (256 x 8), 2-wire Serial EEPROM with a Factory-Programmed EUI-64(TM)Address Plus an Embedded Unique 128-bit Serial Number, 1.7 to 5.5 V, -40 to 85 degC, 5-Pin SOT23 (5TS1), Tape and Reel; Value: EEPROM, 2-Kbit, I2C, with MAC; Package: SOT-23-5; PartNumber: AT24MAC602-STUM-T; ComponentLink1Description: myLinks; ComponentLink1URL: https://cz.mouser.com/ProductDetail/Microchip-Technology-Atmel/AT24MAC602-STUM-T?qs=s44pgLhgXQiuNdSpdYyLLA%3D%3D; Supplier 1: Mouser; Supplier Part Number 1: 556-AT24MAC602-STUMT
U7 = MUX -  SOT-23 - TMUX1308QDYYRQ1: Multiplexer Switch ICs Automotive 5-V, 8:1, 1-channel multiplexer with injection current control and 1.8V logic 16-SOT-23-THN -40 to 125; Value: 8:1 MUX; ComponentLink1Description: myLinks; ComponentLink1URL: https://cz.mouser.com/ProductDetail/Texas-Instruments/TMUX1308QDYYRQ1?qs=xZ%2FP%252Ba9zWqaqz9D2kpWQ%2FA%3D%3D; Package: SOT-23-THIN-16; PartNumber: TMUX1308QDYYRQ1; Supplier 1: Mouser; Supplier Part Number 1: 595-TMUX1308QDYYRQ1
U8 = CAN - PHY - SN65HVD232D: 3.3 V CAN Transceiver, 17 mA, -40 to 85 degC, 8-pin SOIC (D), Green (RoHS & no Sb/Br); Value: 1Mbit CAN , 3-3.6VDC; PartNumber: SN65HVD232D; Package: SOIC-8; Supplier 1: Mouser; Supplier Part Number 1: 595-SN65HVD232D; ComponentLink1Description: myLinks; ComponentLink1URL: https://eu.mouser.com/ProductDetail/Texas-Instruments/SN65HVD232D?qs=QViXGNcIEAueLIS9b8IyYg%3D%3D
U12 = OPAMP - 2CH AD8532ARMZ-REEL: Double Channel Rail-to-Rail Operational Amplifier, 3 MHz BW, 5 V/us SR, Industrial, 8-pin SOP (RM-8), Reel; Value: RAIL TO RAIL OPAMP 3-6V; PartNumber: AD8532ARMZ-REEL; ComponentLink1Description: myLinks; ComponentLink1URL: https://cz.mouser.com/ProductDetail/Analog-Devices/AD8532ARMZ-REEL?qs=%2FtpEQrCGXCwVVXkbCBPc6A%3D%3D; Package: MSOP-8; Supplier 1: Mouser; Supplier Part Number 1: 584-AD8532ARMZ-R
VR1 VR3 = TRIMMER - 1k -100mW: Variable Resistor Trimmer - 1k - 25% -100mW - single turn; PartNumber: TC33X-2-102E; Package: 3mm SMD TRIMPOT; Value: 1k; ComponentLink1Description: myLinks; ComponentLink1URL: https://cz.mouser.com/ProductDetail/Bourns/TC33X-2-102E?qs=2hAPiALdQ0nRULMRC6GCtg%3D%3D; Supplier 1: Mouser; Supplier Part Number 1: 652-TC33X-2-102E
VR4 VR5 = TRIMMER - 50k -100mW: Variable Resistor Trimmer - 50k - 25% -100mW - single turn; PartNumber: TC33X-2-102E; Package: 3mm SMD TRIMPOT; Value: 50k; ComponentLink1Description: myLinks; ComponentLink1URL: https://cz.mouser.com/ProductDetail/Bourns/TC33X-2-503E?qs=tEaODSGlU8NgxHjveDtEEg%3D%3D; Supplier 1: Mouser; Supplier Part Number 1: 652-TC33X-2-102E
Y1 = 8MHz-Osc: Crystal 8MHz ±10ppm CL=18pF SMD-4 5mm x 3.2mm; PartNumber: ABM3B-8.000MHZ-D2-T; ComponentLink1Description: myLinks; ComponentLink1URL: https://cz.mouser.com/ProductDetail/ABRACON/ABM3B-8.000MHZ-D2-T?qs=icabnvfcbsHVTU9nAlXQRw%3D%3D; Package: SMD 4pin OSC; Value: 8MHz; Supplier 1: Mouser; Supplier Part Number 1: 815-ABM3B8000MHZD2T